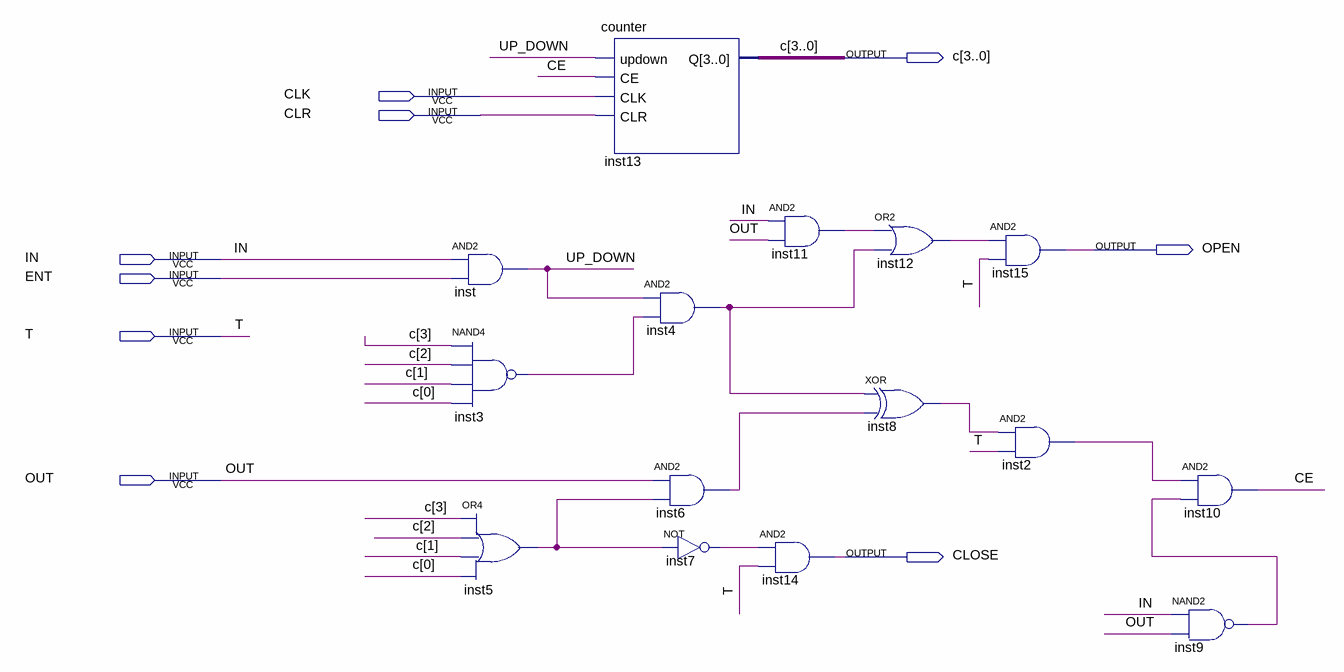
[diagram p0: schematic sheet]
// Quartus schematic WaitingRoom.bdf as structural Verilog: 15 symbols, 9 pins
module WaitingRoom (
  input  CLK,
  input  CLR,
  input  IN,
  input  ENT,
  input  T,
  input  OUT,
  output [3:0] c,
  output OPEN,
  output CLOSE
);

  wire CE, inst2_out, inst3_out, inst4_out, inst5_out, inst6_out, inst7_out, inst8_out, inst9_out,
       inst11_out, inst12_out, UP_DOWN;

  and inst (UP_DOWN, IN, ENT);
  nand inst3 (inst3_out, c[3], c[2], c[1], c[0]);
  or inst5 (inst5_out, c[3], c[2], c[1], c[0]);
  counter inst13 (.updown(UP_DOWN), .CE(CE), .CLK(CLK), .CLR(CLR), .Q(c));
  and inst4 (inst4_out, UP_DOWN, inst3_out);
  and inst6 (inst6_out, OUT, inst5_out);
  not inst7 (inst7_out, inst5_out);
  and inst11 (inst11_out, IN, OUT);
  and inst14 (CLOSE, inst7_out, T);
  xor inst8 (inst8_out, inst4_out, inst6_out);
  or inst12 (inst12_out, inst11_out, inst4_out);
  and inst15 (OPEN, inst12_out, T);
  and inst2 (inst2_out, inst8_out, T);
  nand inst9 (inst9_out, IN, OUT);
  and inst10 (CE, inst2_out, inst9_out);
endmodule
